# EAGLE schematic scheme_granum2016 (EAGLE 7.6.0)
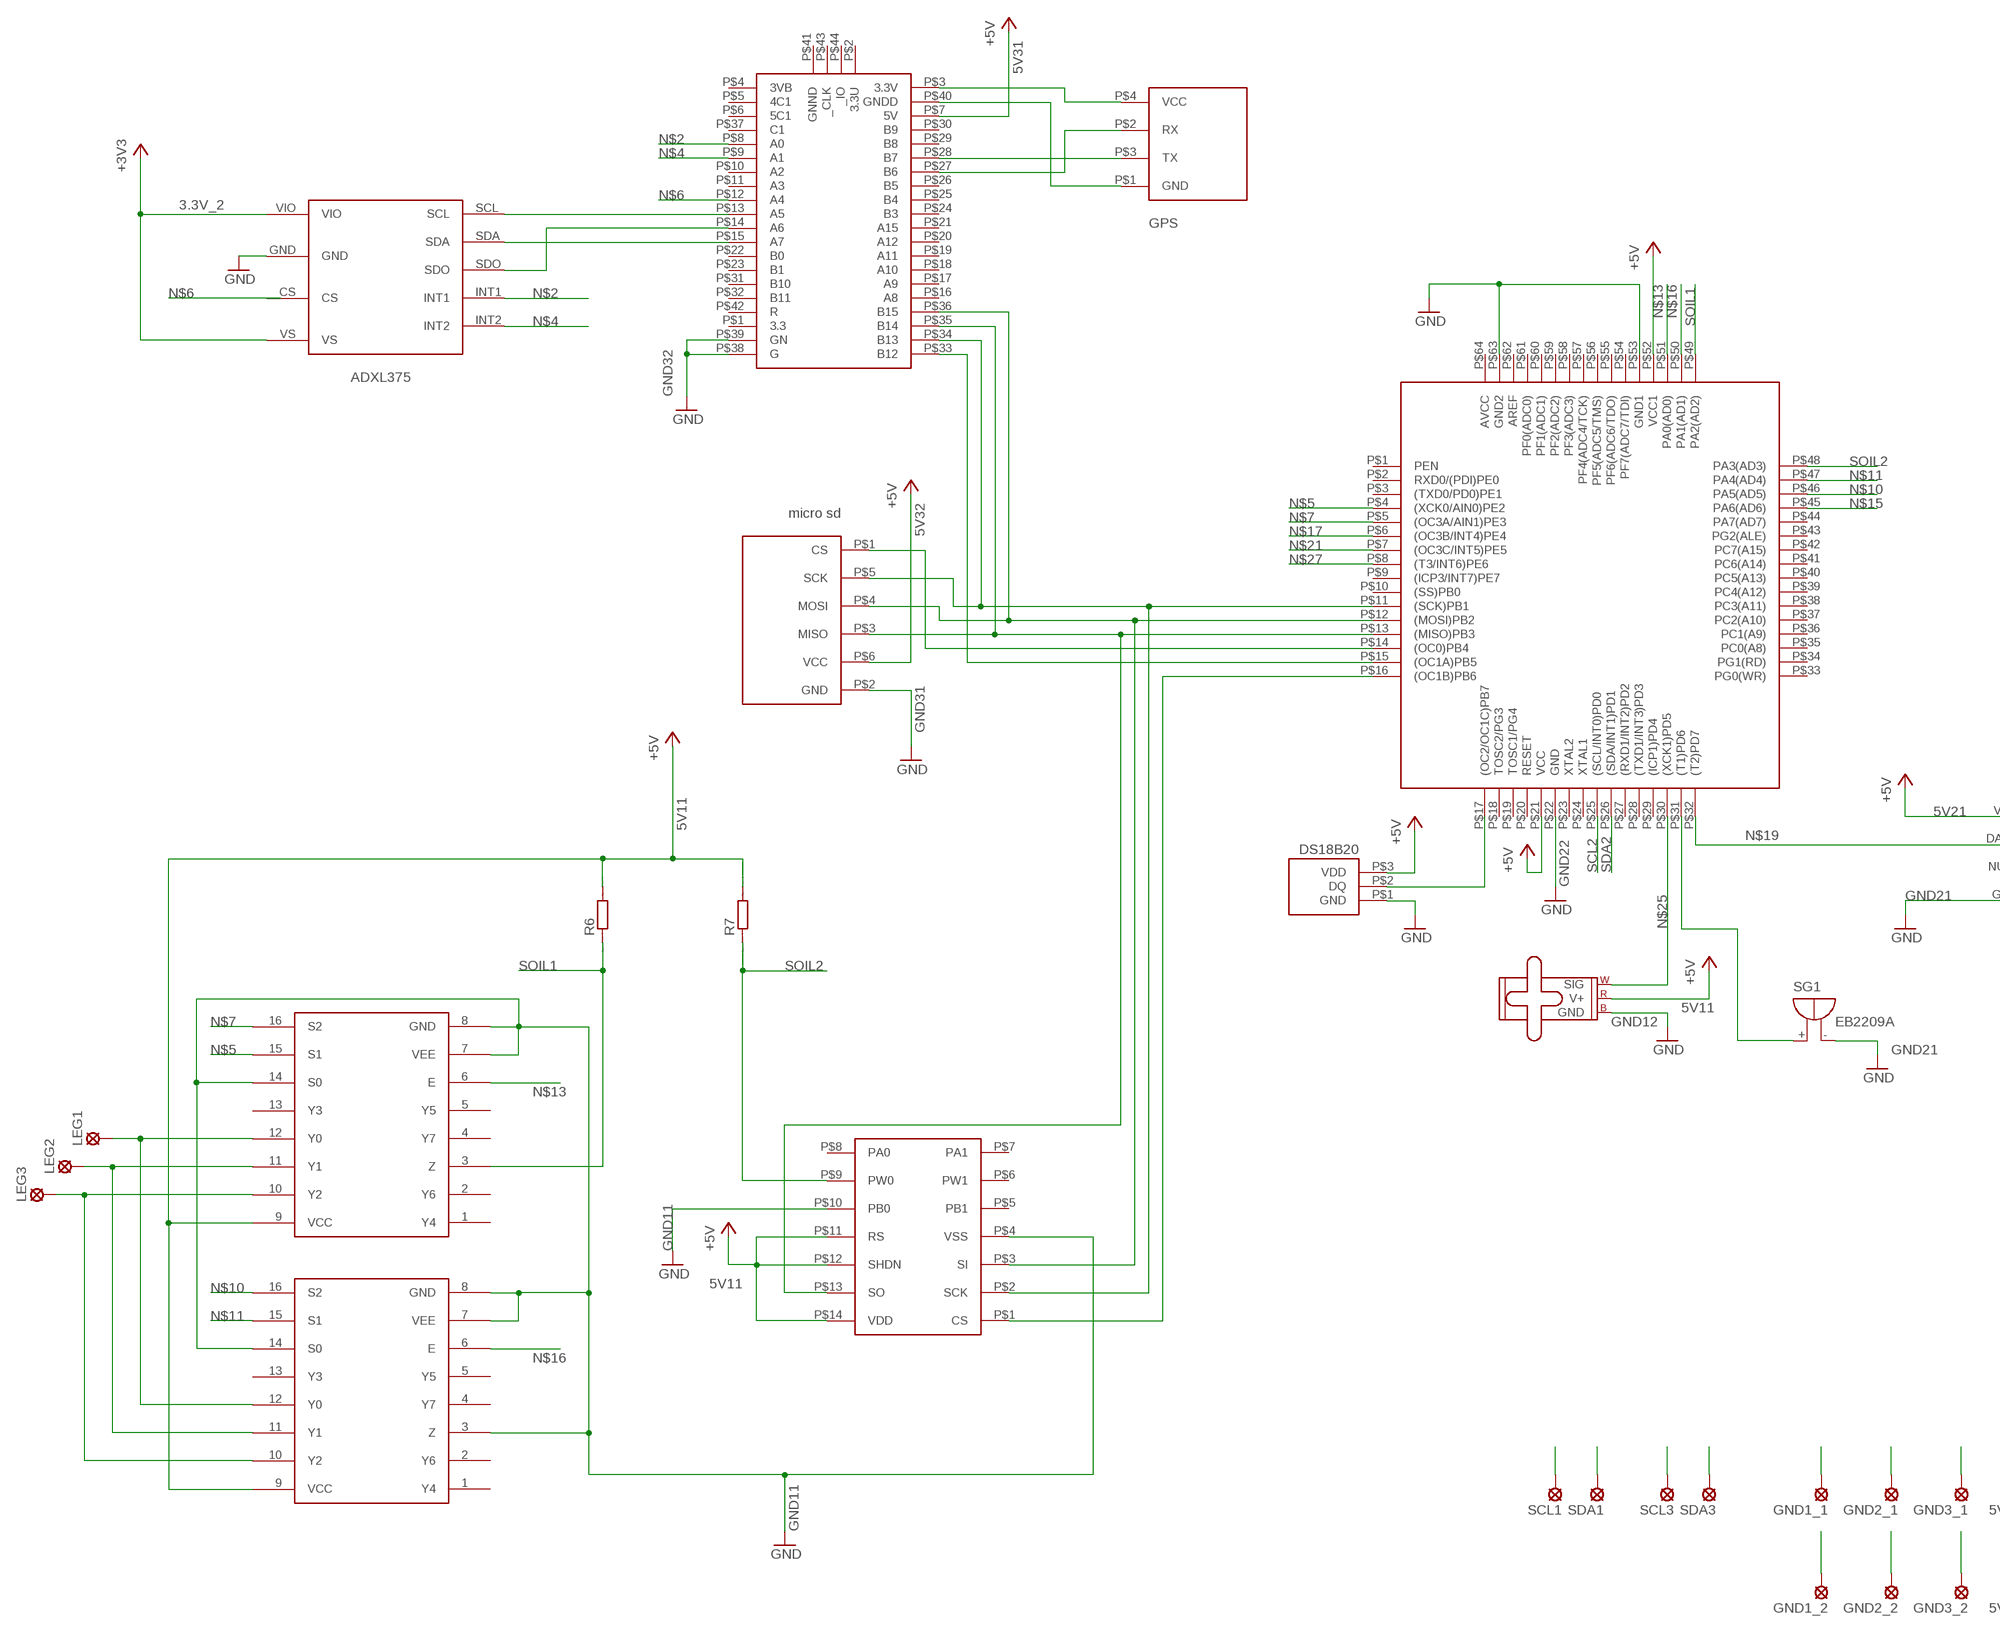
[diagram p0: schematic, sheet 1, part 1 of 2]
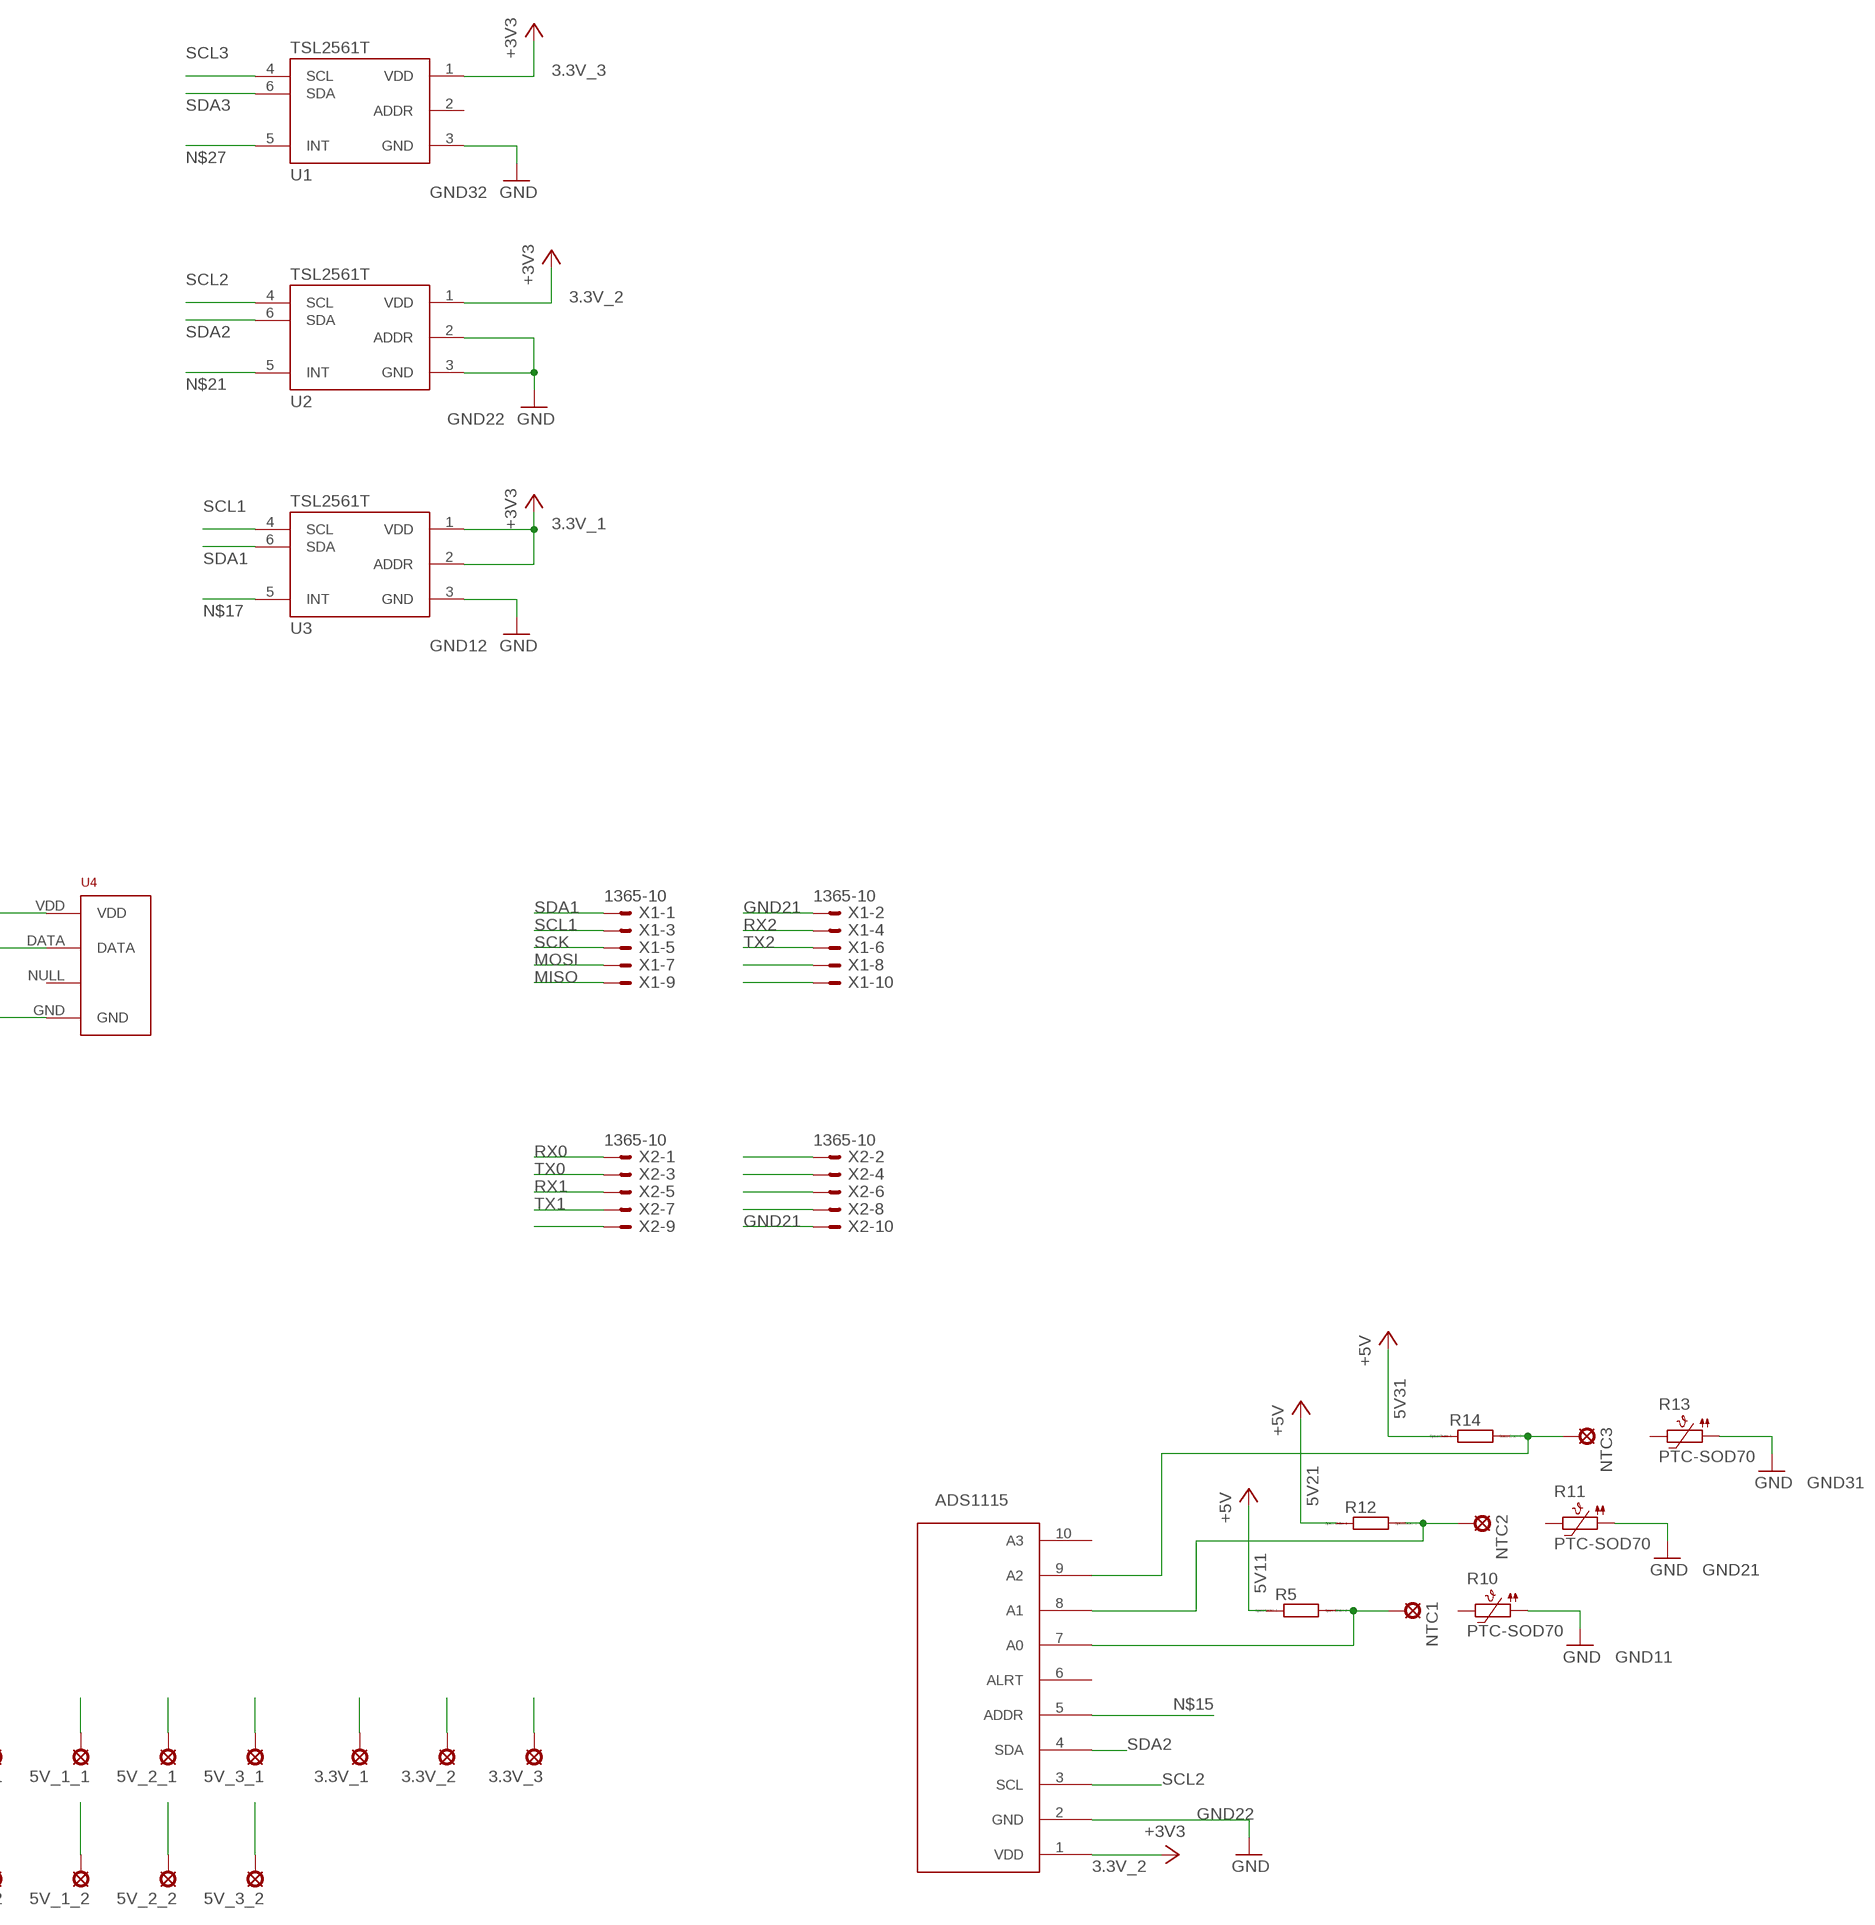
[diagram p1: schematic, sheet 1, part 2 of 2]

## Parts
3.3V_1  LSP10  [LSP10]
3.3V_2  LSP10  [LSP10]
3.3V_3  LSP10  [LSP10]
5V_1_1  LSP10  [LSP10]
5V_1_2  LSP10  [LSP10]
5V_2_1  LSP10  [LSP10]
5V_2_2  LSP10  [LSP10]
5V_3_1  LSP10  [LSP10]
5V_3_2  LSP10  [LSP10]
GND1_1  LSP10  [LSP10]
GND1_2  LSP10  [LSP10]
GND2_1  LSP10  [LSP10]
GND2_2  LSP10  [LSP10]
GND3_1  LSP10  [LSP10]
GND3_2  LSP10  [LSP10]
LEG1  LSP10  [LSP10]
LEG2  LSP10  [LSP10]
LEG3  LSP10  [LSP10]
M1  SMALL_SERVO  [1X03]
NTC1  LSP10  [LSP10]
NTC2  LSP10  [LSP10]
NTC3  LSP10  [LSP10]
R5  R0207/10  [0207/10]
R6  R0207/10  [0207/10]
R7  R0207/10  [0207/10]
R10  PTC-SOD70  [SOD70]
R11  PTC-SOD70  [SOD70]
R12  R0207/10  [0207/10]
R13  PTC-SOD70  [SOD70]
R14  R0207/10  [0207/10]
SCL1  LSP10  [LSP10]
SCL3  LSP10  [LSP10]
SDA1  LSP10  [LSP10]
SDA3  LSP10  [LSP10]
SG1  EB2209A  [EB2209A]
U1  TSL2561T  [TMB-6]
U2  TSL2561T  [TMB-6]
U3  TSL2561T  [TMB-6]
U4  RHT03_DHT-22_AM2302RA  [RHT03_DHT-22/RA]
U$1  ADXL375  [ADXL375]
U$2  DS18B20  [DS18B20]
U$3  MCP42100  [MCP42100]
U$5  74HC4051  [74HC4051]
U$6  74HC4051  [74HC4051]
U$7  ADS1115  [ADS1115]
U$8  STM32  [STM32]
U$9  GPS  [GPS]
U$10  MICRO_SD  [MICRO_SD]
U$11  ATMEGA128  [ATMEGA128]
X1  1365-10  [1365-10]
X2  1365-10  [1365-10]

## Nets
3.3V_1: 3.3V_1.MP U3.1(VDD) U3.2(ADDR) ; supply symbol labelled +3V3
3.3V_2: 3.3V_2.MP U2.1(VDD) U$1.VIO U$1.VS U$7.1(VDD) ; supply symbol labelled +3V3
3.3V_3: 3.3V_3.MP U1.1(VDD) U$8.P$3(3.3V) U$9.P$4(VCC) ; supply symbol labelled +3V3
5V11: 5V_1_1.MP M1.2(V+) R5.1 R6.2 R7.2 U$3.P$11(RS) U$3.P$12(SHDN) U$3.P$14(VDD) U$5.9(VCC) U$6.9(VCC) ; supply symbol labelled +5V
5V12: 5V_1_2.MP
5V21: 5V_2_1.MP R12.1 U4.VDD ; supply symbol labelled +5V
5V22: 5V_2_2.MP U$11.P$21(VCC) U$11.P$52(VCC1) ; supply symbol labelled +5V
5V31: 5V_3_1.MP R14.1 U$8.P$7(5V) ; supply symbol labelled +5V
5V32: 5V_3_2.MP U$10.P$6(VCC) ; supply symbol labelled +5V
+5V: U$2.P$3(VDD)
GND: U$2.P$1(GND) U$11.P$53(GND1) U$11.P$63(GND2)
GND11: GND1_1.MP R10.1 U$3.P$4(VSS) U$3.P$10(PB0) U$5.3(Z) U$5.7(VEE) U$5.8(GND) U$5.14(S0) U$6.7(VEE) U$6.8(GND) U$6.14(S0) ; supply symbol labelled GND
GND12: GND1_2.MP M1.3(GND) U3.3(GND) ; supply symbol labelled GND
GND21: GND2_1.MP R11.1 SG1.- U4.GND U$1.GND X1.2 X2.10 ; supply symbol labelled GND
GND22: GND2_2.MP U2.2(ADDR) U2.3(GND) U$7.2(GND) U$11.P$22(GND) ; supply symbol labelled GND
GND31: GND3_1.MP R13.1 U$8.P$40(GNDD) U$9.P$1(GND) U$10.P$2(GND) ; supply symbol labelled GND
GND32: GND3_2.MP U1.3(GND) U$8.P$38(G) U$8.P$39(GN) ; supply symbol labelled GND
MISO: U$3.P$13(SO) U$8.P$35(B14) U$10.P$3(MISO) U$11.P$13((MISO)PB3) X1.9
MOSI: U$3.P$3(SI) U$8.P$36(B15) U$10.P$4(MOSI) U$11.P$12((MOSI)PB2) X1.7
N$1: U$8.P$33(B12) U$11.P$15((OC1A)PB5)
N$2: U$1.INT1 U$8.P$8(A0)
N$3: U$10.P$1(CS) U$11.P$14((OC0)PB4)
N$4: U$1.INT2 U$8.P$9(A1)
N$5: U$6.15(S1) U$11.P$4((XCK0/AIN0)PE2)
N$6: U$8.P$12(A4)
N$7: U$6.16(S2) U$11.P$5((OC3A/AIN1)PE3)
N$8: U$1.SCL U$8.P$13(A5)
N$9: U$2.P$2(DQ) U$11.P$17((OC2/OC1C)PB7)
N$10: U$5.16(S2) U$11.P$46(PA5(AD5))
N$11: U$5.15(S1) U$11.P$47(PA4(AD4))
N$12: LEG3.MP U$5.10(Y2) U$6.10(Y2)
N$13: U$6.6(E) U$11.P$51(PA0(AD0))
N$14: LEG1.MP U$5.12(Y0) U$6.12(Y0)
N$15: U$7.5(ADDR) U$11.P$45(PA6(AD6))
N$16: U$5.6(E) U$11.P$50(PA1(AD1))
N$17: U3.5(INT) U$11.P$6((OC3B/INT4)PE4)
N$18: U$1.SDO U$8.P$14(A6)
N$19: U4.DATA U$11.P$32((T2)PD7)
N$20: NTC1.MP R5.2 U$7.7(A0)
N$21: U2.5(INT) U$11.P$7((OC3C/INT5)PE5)
N$22: LEG2.MP U$5.11(Y1) U$6.11(Y1)
N$23: U$1.SDA U$8.P$15(A7)
N$25: M1.1(SIG) U$11.P$30((XCK1)PD5)
N$26: NTC2.MP R12.2 U$7.8(A1)
N$27: U1.5(INT) U$11.P$8((T3/INT6)PE6)
N$30: NTC3.MP R14.2 U$7.9(A2)
N$32: U$3.P$1(CS) U$11.P$16((OC1B)PB6)
N$35: X2.9
N$36: SG1.+ U$11.P$31((T1)PD6)
N$37: X2.2
N$39: X2.4
N$40: X2.6
N$41: X2.8
N$44: X1.8
N$45: X1.10
RX0: X2.1
RX1: X2.5
RX2: U$8.P$27(B6) U$9.P$2(RX) X1.4
SCK: U$3.P$2(SCK) U$8.P$34(B13) U$10.P$5(SCK) U$11.P$11((SCK)PB1) X1.5
SCL1: SCL1.MP U3.4(SCL) X1.3
SCL2: U2.4(SCL) U$7.3(SCL) U$11.P$25((SCL/INT0)PD0)
SCL3: SCL3.MP U1.4(SCL)
SDA1: SDA1.MP U3.6(SDA) X1.1
SDA2: U2.6(SDA) U$7.4(SDA) U$11.P$26((SDA/INT1)PD1)
SDA3: SDA3.MP U1.6(SDA)
SOIL1: R6.1 U$6.3(Z) U$11.P$49(PA2(AD2))
SOIL2: R7.1 U$3.P$9(PW0) U$11.P$48(PA3(AD3))
TX0: X2.3
TX1: X2.7
TX2: U$8.P$28(B7) U$9.P$3(TX) X1.6
Unconnected: R10.2 R11.2 R13.2 U1.2(ADDR) U4.NULL U$1.CS U$3.P$5(PB1) U$3.P$6(PW1) U$3.P$7(PA1) U$3.P$8(PA0) U$5.1(Y4) U$5.2(Y6) U$5.4(Y7) U$5.5(Y5) U$5.13(Y3) U$6.1(Y4) U$6.2(Y6) U$6.4(Y7) U$6.5(Y5) U$6.13(Y3) U$7.6(ALRT) U$7.10(A3) U$8.P$1(3.3) U$8.P$2(3.3U) U$8.P$4(3VB) U$8.P$5(4C1) U$8.P$6(5C1) U$8.P$10(A2) U$8.P$11(A3) U$8.P$16(A8) U$8.P$17(A9) U$8.P$18(A10) U$8.P$19(A11) U$8.P$20(A12) U$8.P$21(A15) U$8.P$22(B0) U$8.P$23(B1) U$8.P$24(B3) U$8.P$25(B4) U$8.P$26(B5) U$8.P$29(B8) U$8.P$30(B9) U$8.P$31(B10) U$8.P$32(B11) U$8.P$37(C1) U$8.P$41(GNND) U$8.P$42(R) U$8.P$43(_CLK) U$8.P$44(_IO) U$11.P$1(PEN) U$11.P$2(RXD0/(PDI)PE0) U$11.P$3((TXD0/PD0)PE1) U$11.P$9((ICP3/INT7)PE7) U$11.P$10((SS)PB0) U$11.P$18(TOSC2/PG3) U$11.P$19(TOSC1/PG4) U$11.P$20(RESET) U$11.P$23(XTAL2) U$11.P$24(XTAL1) U$11.P$27((RXD1/INT2)PD2) U$11.P$28((TXD1/INT3)PD3) U$11.P$29((ICP1)PD4) U$11.P$33(PG0(WR)) U$11.P$34(PG1(RD)) U$11.P$35(PC0(A8)) U$11.P$36(PC1(A9)) U$11.P$37(PC2(A10)) U$11.P$38(PC3(A11)) U$11.P$39(PC4(A12)) U$11.P$40(PC5(A13)) U$11.P$41(PC6(A14)) U$11.P$42(PC7(A15)) U$11.P$43(PG2(ALE)) U$11.P$44(PA7(AD7)) U$11.P$54(PF7(ADC7/TDI)) U$11.P$55(PF6(ADC6/TDO)) U$11.P$56(PF5(ADC5/TMS)) U$11.P$57(PF4(ADC4/TCK)) U$11.P$58(PF3(ADC3)) U$11.P$59(PF2(ADC2)) U$11.P$60(PF1(ADC1)) U$11.P$61(PF0(ADC0)) U$11.P$62(AREF) U$11.P$64(AVCC)

## Notes on the sheet
- ADS1115

## Library data of the parts
3.3V_1-3.3V_3 5V_1_1 5V_1_2 5V_2_1 5V_2_2 5V_3_1 5V_3_2 GND1_1 GND1_2 GND2_1 GND2_2 GND3_1 GND3_2 LEG1-LEG3 NTC1-NTC3 SCL1 SCL3 SDA1 SDA3 = solpad:LSP10: SOLDER PAD drill 1.0 mm, distributor Buerklin, 12H555
M1 = SparkFun-Electromechanical:SMALL_SERVO: Small servo motor This is the small servo used in the SIK. SKU: ROB-09065
R5-R7 R12 R14 = eagle-ltspice:R: RESISTOR, European symbol; SPICEMODEL: NONE; SPICEPREFIX: R
R10 R11 R13 = ptc-ntc:PTC-: Positive Temperature Coefficient Resistor (PTC) termistor Philips KTY81-210 - KTY81-252 Source: 153627-da-01-en-Temperatur-Sensor_KTY10-6_Philips.pdf; OC_FARNELL: unknown; OC_NEWARK: unknown
SG1 = buzzer:EB2209A: BUZZER Source: Buerklin; OC_FARNELL: unknown; OC_NEWARK: unknown
U1-U3 = SparkFun-DigitalIC:TSL2561: TSL2561 illumination sensor Approximates Human Eye Response Precisely Measures Illuminance Programmable Interrupt Function with User-Defined Upper and Lower Threshold 400 KHz I2C interface Programmable Analog Gain and Integration Time Supporting 1,000,000-to-1 Dynamic Range Automatically Rejects 50/60-Hz Lighting Ripple Low Active Power (0.75 mW Typical) with Power Down Mode RoHS Compliant The TSL2561 is a light-to-digital converter that transform light intensity to a digital signal output via I2C interface. The device combines one broadband photodiode (visible plus infrared) and one infrared-responding photodiode on a single CMOS integrated circuit capable of providing a near-photopic response over an effective 20-bit dynamic range (16-bit resolution). Two integrating ADCs convert the photodiode currents to a digital output that represents the irradiance measured on each channel. This digital output can be input to a microprocessor where illuminance (ambient light level) in lux is derived using an empirical formula to approximate the human eye response. The TSL2561 device supports a traditional level style interrupt that remains asserted until the firmware clears it.
U4 = RHT03_DHT-22_AM2302:RHT03_DHT-22_AM2302: RHT03 / DHT-22 / AM2302 Packages and symbol for the RHT03 / DHT-22 relative humidity and temperature sensor. Note: The AM2302 is a wired version of the DHT-22 which typically requires less clearance and is thus provided as a separate package.; PROD_ID: SEN-10167
U$1 = untitled:ADXL375
U$2 = elements_cs2016:DS18B20
U$3 = elements_cs2016:MCP42100
U$5 U$6 = elements_cs2016:74HC4051
U$7 = elements_cs2016:ADS1115
U$8 = elements_cs2016:STM32
U$9 = elements_cs2016:GPS
U$10 = elements_cs2016:MICRO_SD
U$11 = elements_cs2016:ATMEGA128
X1 X2 = con-leotronics:1365-10: DUAL ROW STRAIGHT HEADER 1364 SERIES. 1.27mm x 1.27mm. Without Fixing Post. SMT Source: http://www.leotronics.co.uk/Conexcon/Data%20Sheets/sec.%20A/1364ing.pdf; OC_FARNELL: unknown; OC_NEWARK: unknown